# Altium schematic sheet MCP3564_breakout.SchDoc
size 431 x 279 mm; SheetNumber: 1; SheetTotal: 1; ENG_APP_DATE: --/--/--; DSN_APP_DATE: --/--/--; CHK_APP_DATE: --/--/--
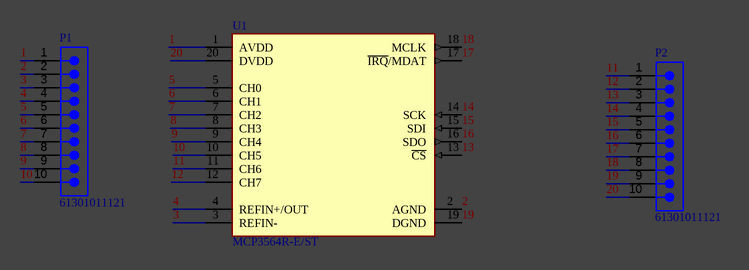
[diagram p0: MCP3564_breakout.SchDoc]

## Parts
P1  61301011121  [61301011121]
P2  61301011121  [61301011121]
U1  MCP3564R-E/ST  [FP-C04-088-MFG]

## Nets
1: P1.1 U1.1(AVDD)
2: P1.2 U1.2(AGND)
3: P1.3 U1.3(REFIN-)
4: P1.4 U1.4(REFIN+/OUT)
5: P1.5 U1.5(CH0)
6: P1.6 U1.6(CH1)
7: P1.7 U1.7(CH2)
8: P1.8 U1.8(CH3)
9: P1.9 U1.9(CH4)
10: P1.10 U1.10(CH5)
11: P2.1 U1.11(CH6)
12: P2.2 U1.12(CH7)
13: P2.3 U1.13(~{CS})
14: P2.4 U1.14(SCK)
15: P2.5 U1.15(SDI)
16: P2.6 U1.16(SDO)
17: P2.7 U1.17(~{IRQ}/MDAT)
18: P2.8 U1.18(MCLK)
19: P2.9 U1.19(DGND)
20: P2.10 U1.20(DVDD)

## Notes on the sheet
- DWG. NO.
- REV.
- SHT.
- THIS DOCUMENT AND THE DATA DISCLOSED HEREIN OR HEREWITH IS THE PROPERTY OF ALTIUM LIMITED AND MAY BE FREELY DISTRIBUTED IN WHOLE. NO RIGHTS ARE RESERVED OR EXPRESS OR IMPLIED WARANTEE GIVEN.
- REVISION
- DESCRIPTION
- DATE
- APPROVED
- ENG:
- APPROVALS
- PROJECT
- DSN:
- CHK:
- REFERENCE DOCUMENTS
- PROJECT REVISION:
- TITLE
- DOCUMENT REVISION:
- DESIGN ITEM:
- BOM:
- FAB DWG:
- PCB DWG:
- ASSY DWG:
- SCALE:
- SIZE
- B
- CAGE CODE
- FILE NAME
- DWG NO.
- SHEET
- OF
- REV

## Library data of the parts
P1 P2 = CMP-1502-01082-5: NexarPartId: 18818159; Gender: Male; Number of Positions: 10; Operating Supply Voltage: 250V; Current Rating: 3A; Contact Resistance: 20mΩ; Connector Type: Male Pin; Insulation Resistance: 1GΩ; Pitch: 2.54mm; System: Connector; Color: Black; Contact Gender: Male; Height: 8.74mm; Orientation: Vertical; RoHS: Compliant; Packaging: Bulk; Min Operating Temperature: -40°C; Number of Pins: 10; Max Operating Temperature: 105°C; REACH SVHC: Unknown; Voltage Rating: 250V; Number of Rows: 1; Housing Material: PBT; Number of Contacts: 10; Mount: Through Hole; Contact Mating Length: 5.9944mm; Length: 2.54mm; Lead Pitch: 2.54mm; Flammability Rating: UL94 V-0; Termination: Solder; Contact Material: Copper; Width: 25.4mm; Contact Plating: Gold
U1 = CMP-00252-111742343-1: MCP3564R-E/ST 8-Channel Single ADC Delta-Sigma 153.6ksps 24-bit Serial 20-Pin TSSOP Tube; Interface: SPI; Max Junction Temperature (Tj): 150°C; Min Supply Voltage: 1.8V; Number of Channels: 8; Max Supply Voltage: 3.6V; Number of Converters: 1; Max Operating Temperature: 125°C; Lifecycle Status: Production; Height: 1.2mm; Ambient Temperature Range High: 125°C; NexarPartId: 111742343; Sampling Rate: 153.6ksps; Min Operating Temperature: -40°C